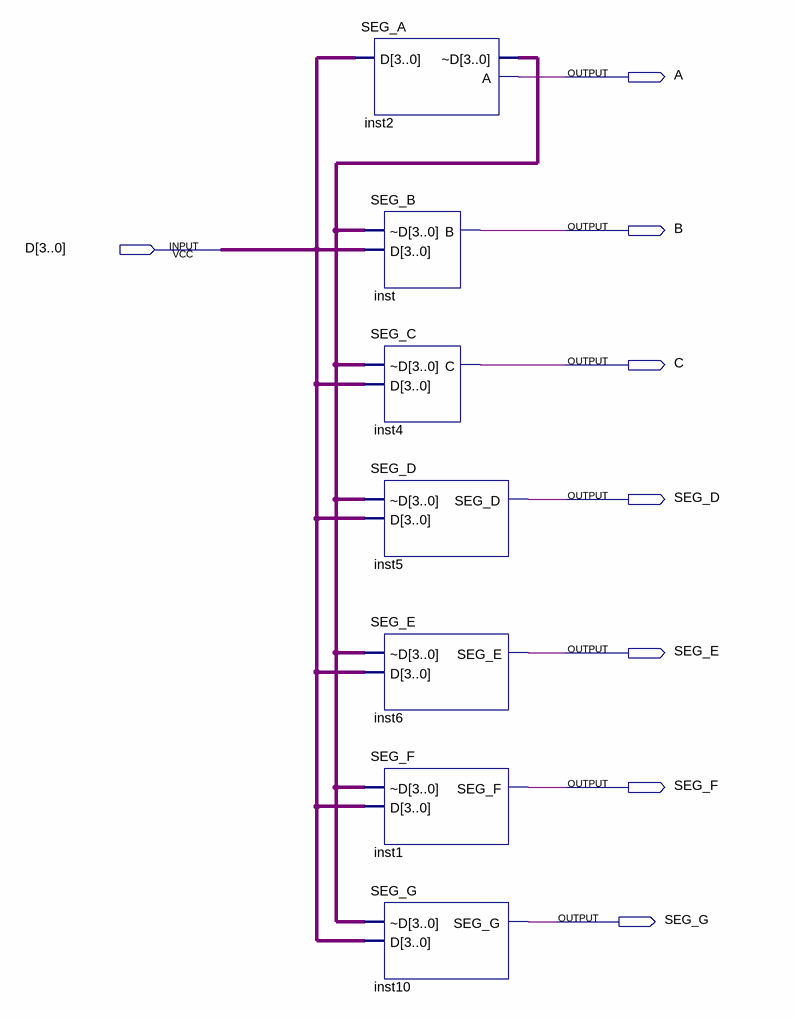
[diagram p0: schematic sheet]
// Quartus schematic 7SEG.bdf as structural Verilog: 7 symbols, 8 pins
module \7SEG  (
  input  [3:0] D,
  output A,
  output B,
  output C,
  output SEG_D,
  output SEG_E,
  output SEG_F,
  output SEG_G
);

  wire [3:0] inst2__d;

  SEG_A inst2 (.D(D), .\~D (inst2__d), .A(A));
  SEG_B inst (.\~D (inst2__d), .D(D), .B(B));
  SEG_C inst4 (.\~D (inst2__d), .D(D), .C(C));
  SEG_D inst5 (.\~D (inst2__d), .D(D), .SEG_D(SEG_D));
  SEG_E inst6 (.\~D (inst2__d), .D(D), .SEG_E(SEG_E));
  SEG_F inst1 (.\~D (inst2__d), .D(D), .SEG_F(SEG_F));
  SEG_G inst10 (.\~D (inst2__d), .D(D), .SEG_G(SEG_G));
endmodule
